# Altium schematic sheet Boost Power Stage.SchDoc
size A; SheetNumber: 3; SheetTotal: 3
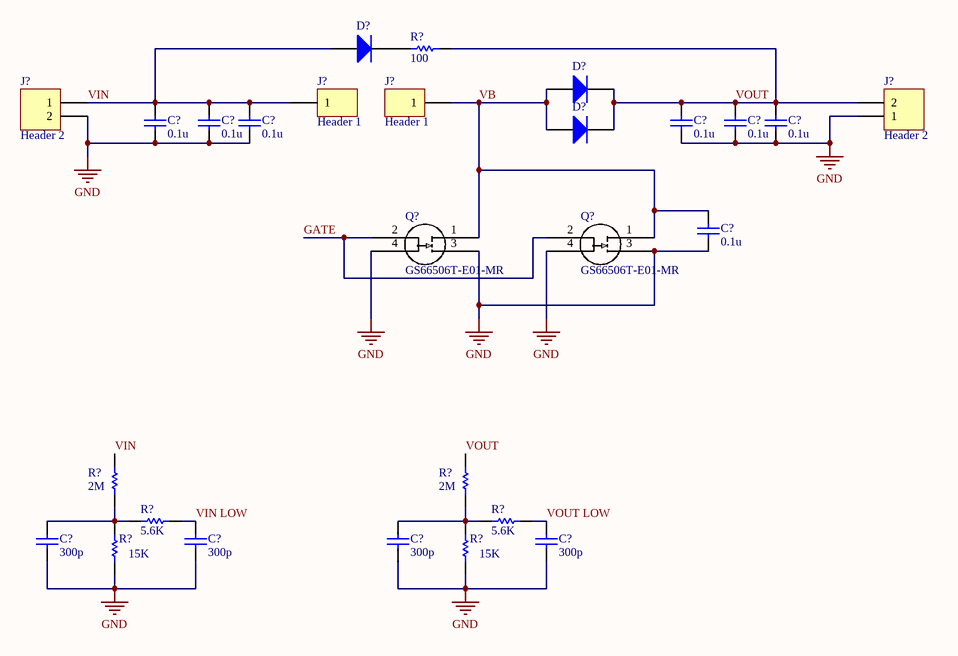
[diagram p0: Boost Power Stage.SchDoc]

## Parts
(Parts that share a designator on the sheet are numbered #1, #2 ... from top to bottom, then left to right.)
C?#1  value 0.1u  (hidden comment: Capacitor)
C?#2  value 0.1u  (hidden comment: Capacitor)
C?#3  value 0.1u  (hidden comment: Capacitor)
C?#4  value 0.1u  (hidden comment: Capacitor)
C?#5  value 0.1u  (hidden comment: Capacitor)
C?#6  value 0.1u  (hidden comment: Capacitor)
C?#7  value 0.1u  (hidden comment: Capacitor)
C?#8  value 300p  (hidden comment: Capacitor)
C?#9  value 300p  (hidden comment: Capacitor)
C?#10  value 300p  (hidden comment: Capacitor)
C?#11  value 300p  (hidden comment: Capacitor)
D?#1  Diode  (value not drawn)
D?#2  Diode  (value not drawn)
D?#3  Diode  (value not drawn)
J?#1  Header 2  [PheonixContact_1757242]
J?#2  Header 1  [GNDOUT]
J?#3  Header 1  [GNDOUT]
J?#4  Header 2  [PheonixContact_1757242]
Q?#1  GS66506T-E01-MR  [GS66506T-E01-MR_GAN]
Q?#2  GS66506T-E01-MR  [GS66506T-E01-MR_GAN]
R?#1  value 100  (hidden comment: Resistor)
R?#2  value 2M  (hidden comment: Resistor)
R?#3  value 2M  (hidden comment: Resistor)
R?#4  value 5.6K  (hidden comment: Resistor)
R?#5  value 5.6K  (hidden comment: Resistor)
R?#6  value 15K  (hidden comment: Resistor)
R?#7  value 15K  (hidden comment: Resistor)

## Nets
GND: C?#1.1 C?#2.1 C?#3.1 C?#4.1 C?#5.1 C?#6.1 C?#7.1 C?#8.1 C?#9.1 C?#10.1 C?#11.1 J?#1.2 J?#4.1 Q?#1.3 Q?#1.4 Q?#2.3 Q?#2.4 R?#6.1 R?#7.1
GATE: Q?#1.2 Q?#2.2
VB: C?#7.2 D?#2.1(A) D?#3.1(A) J?#2.1 Q?#1.1 Q?#2.1
VIN: C?#1.2 C?#2.2 C?#3.2 D?#1.1(A) J?#1.1 J?#3.1 R?#2.2
VIN LOW: C?#9.2 R?#4.1
VOUT: C?#4.2 C?#5.2 C?#6.2 D?#2.2(K) D?#3.2(K) J?#4.2 R?#1.1 R?#3.2
VOUT LOW: C?#11.2 R?#5.1
NetC?#8_2: C?#8.2 R?#2.1 R?#4.2 R?#6.2
NetC?#10_2: C?#10.2 R?#3.1 R?#5.2 R?#7.2
NetD?#1_2: D?#1.2(K) R?#1.2

## Library data of the parts
C?#1-C?#11 = Capacitor: SimulationGenericComponent: True
D?#1-D?#3 = Diode: AF: 1; BV: 0; BV_MAX: 1e99; EG: 1.11; FC: 0.5; IBV: 0.001; ISR: 1e-14; MJSW: 0.33; NTUN: 30; TNOM: 27; XTI: 3; SimulationGenericComponent: True; CJO: 0; CJP: 0; CTA: 0; CTP: 0; FCS: 0.5; FV_MAX: 1e99; IKF: 0; IKR: 0; JSW: 0; JTUN: 0; JTUNSW: 0; KEG: 1; KF: 0; LEVEL: 1; N: 1; NBV: 1; NR: 1; NS: 1; PHP: 1; RS: 0; TCV: 0; TLEV: 0; TLEVC: 0; TM1: 0; TM2: 0; TPB: 0; TPHP: 0; TRS: 0; TRS2: 0; TT: 0; TTT1: 0; TTT2: 0; VJ: 1; XTITUN: 3; IS: 1e-14
J?#1 J?#4 = Header 2: Header, 2-Pin; LatestRevisionDate: 17-Jul-2002; LatestRevisionNote: Re-released for DXP Platform.; Publisher: Altium Limited
J?#2 J?#3 = Header 1: Header, 1-Pin; LatestRevisionDate: 17-Jul-2002; LatestRevisionNote: Re-released for DXP Platform.; Publisher: Altium Limited
Q?#1 Q?#2 = GS66506T-E01-MR: No Description Available; Manufacturer_Name: GaN Systems; Copyright: Copyright (C) 2025 Ultra Librarian. All rights reserved.; Manufacturer_Part_Number: GS66506T-E01-MR; RefDes: RefDes; Type: Type
R?#1-R?#7 = Resistor: TC1: 0; SimulationGenericComponent: True; TC2: 0